# EasyEDA Pro project TDX_Lite_testboard_1.0.epro

# Board mai_io
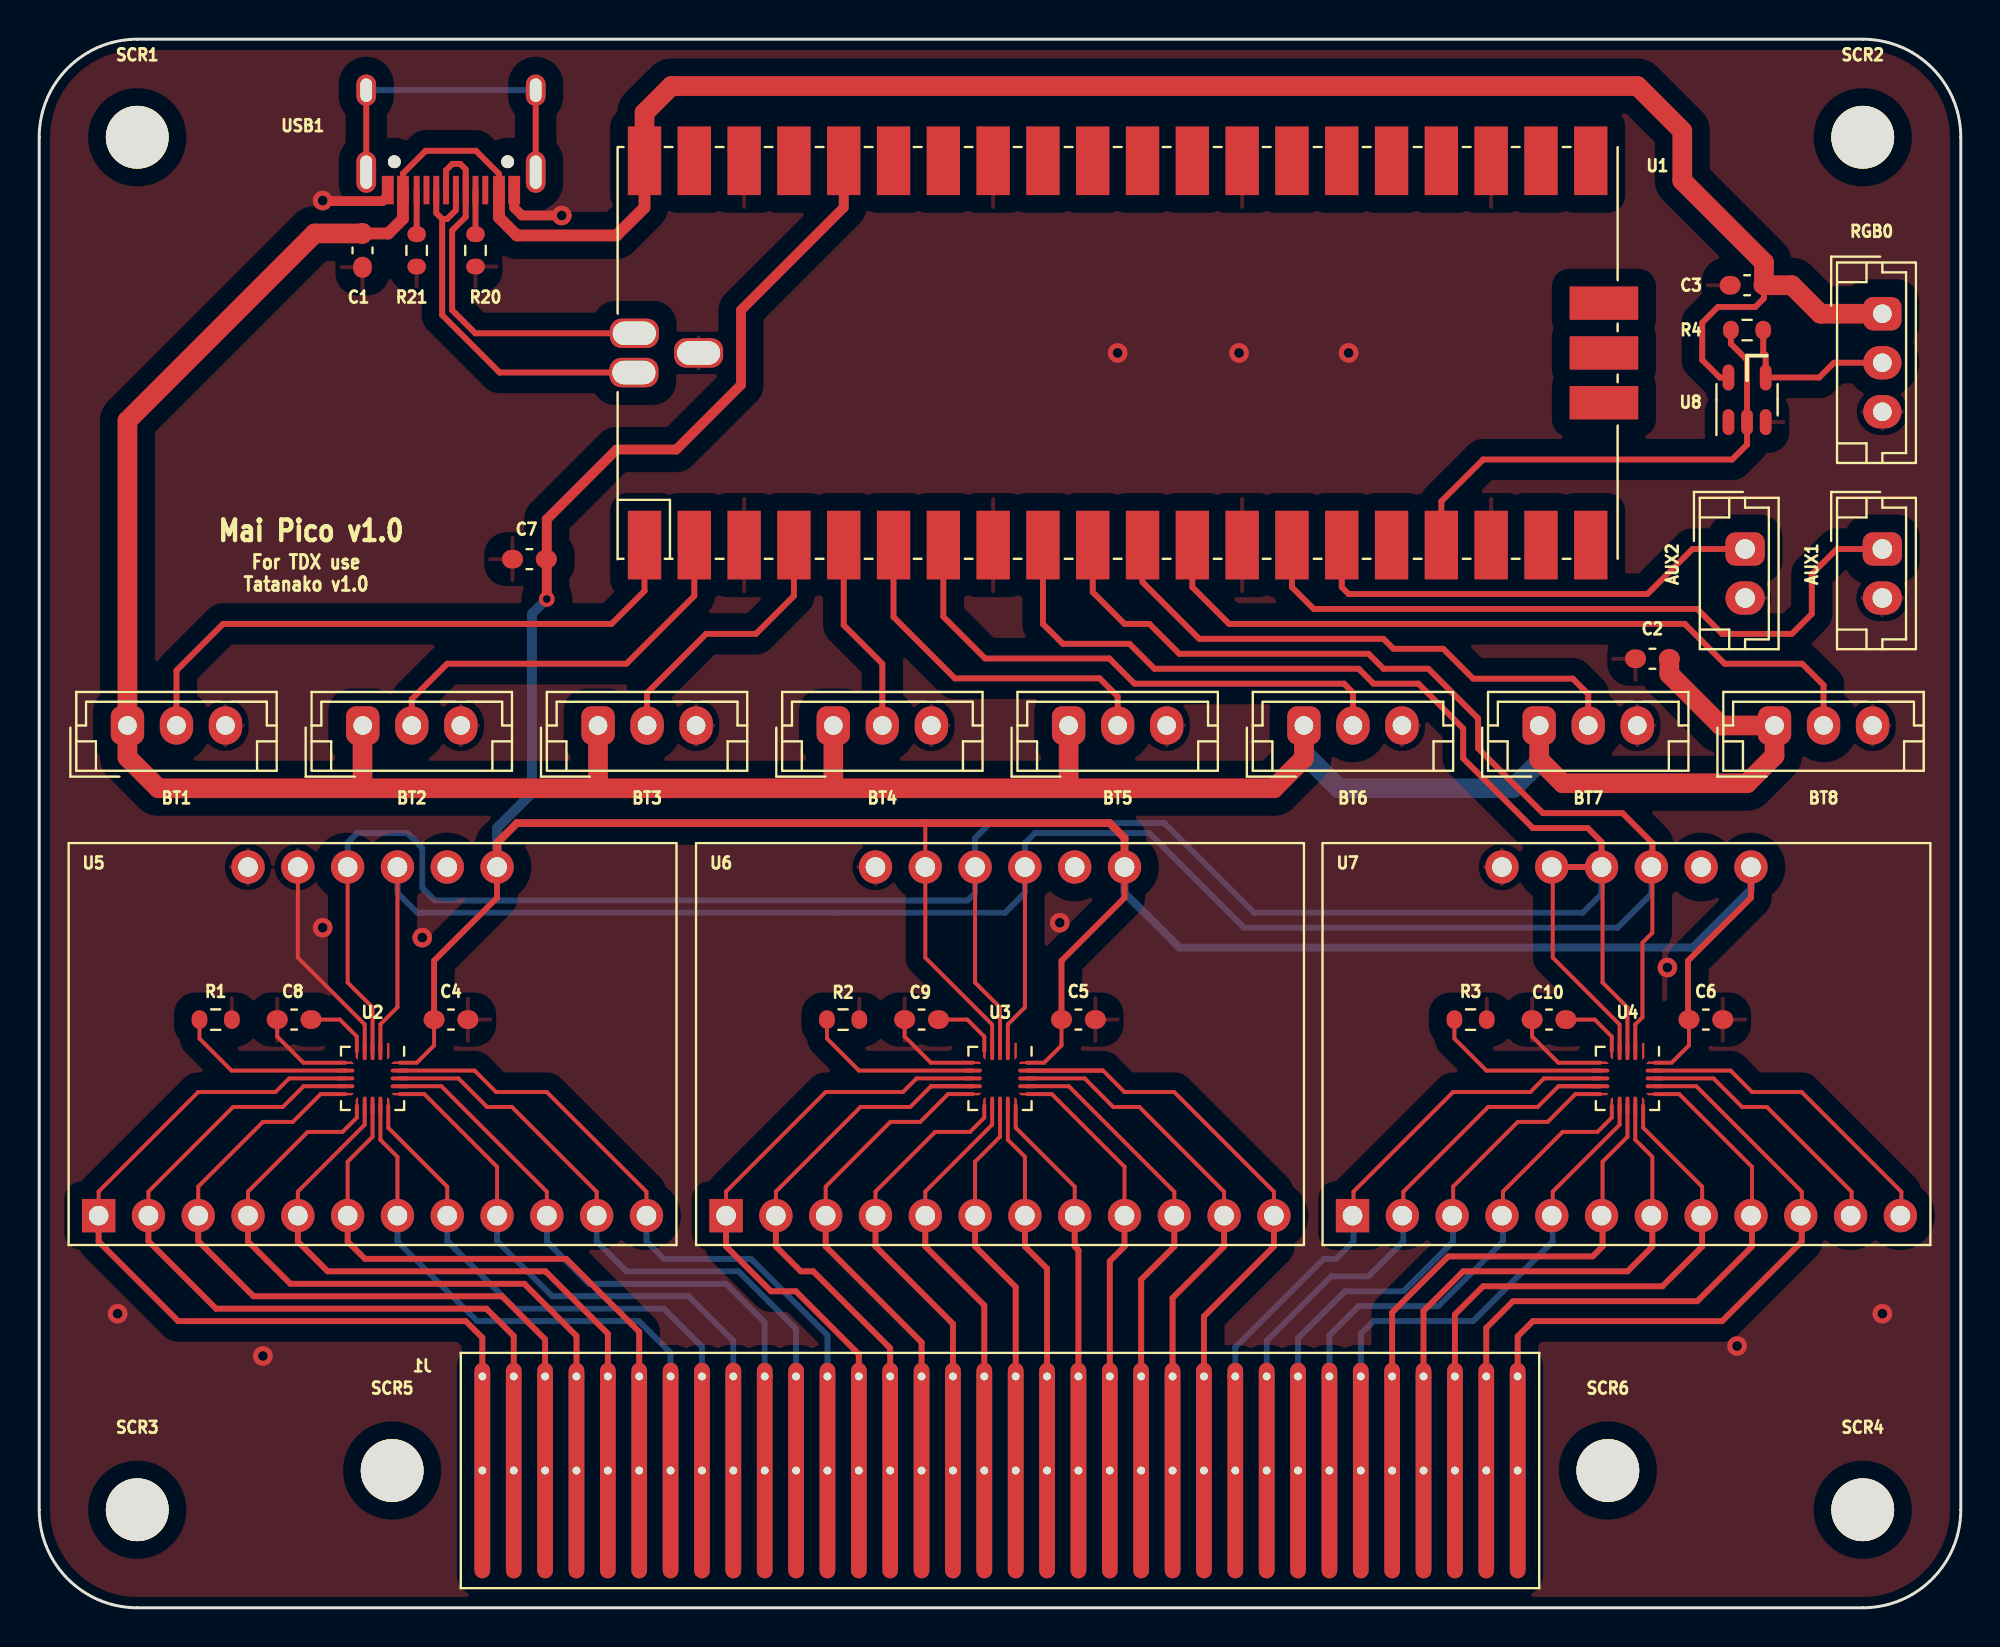
[diagram p0: board, top side]
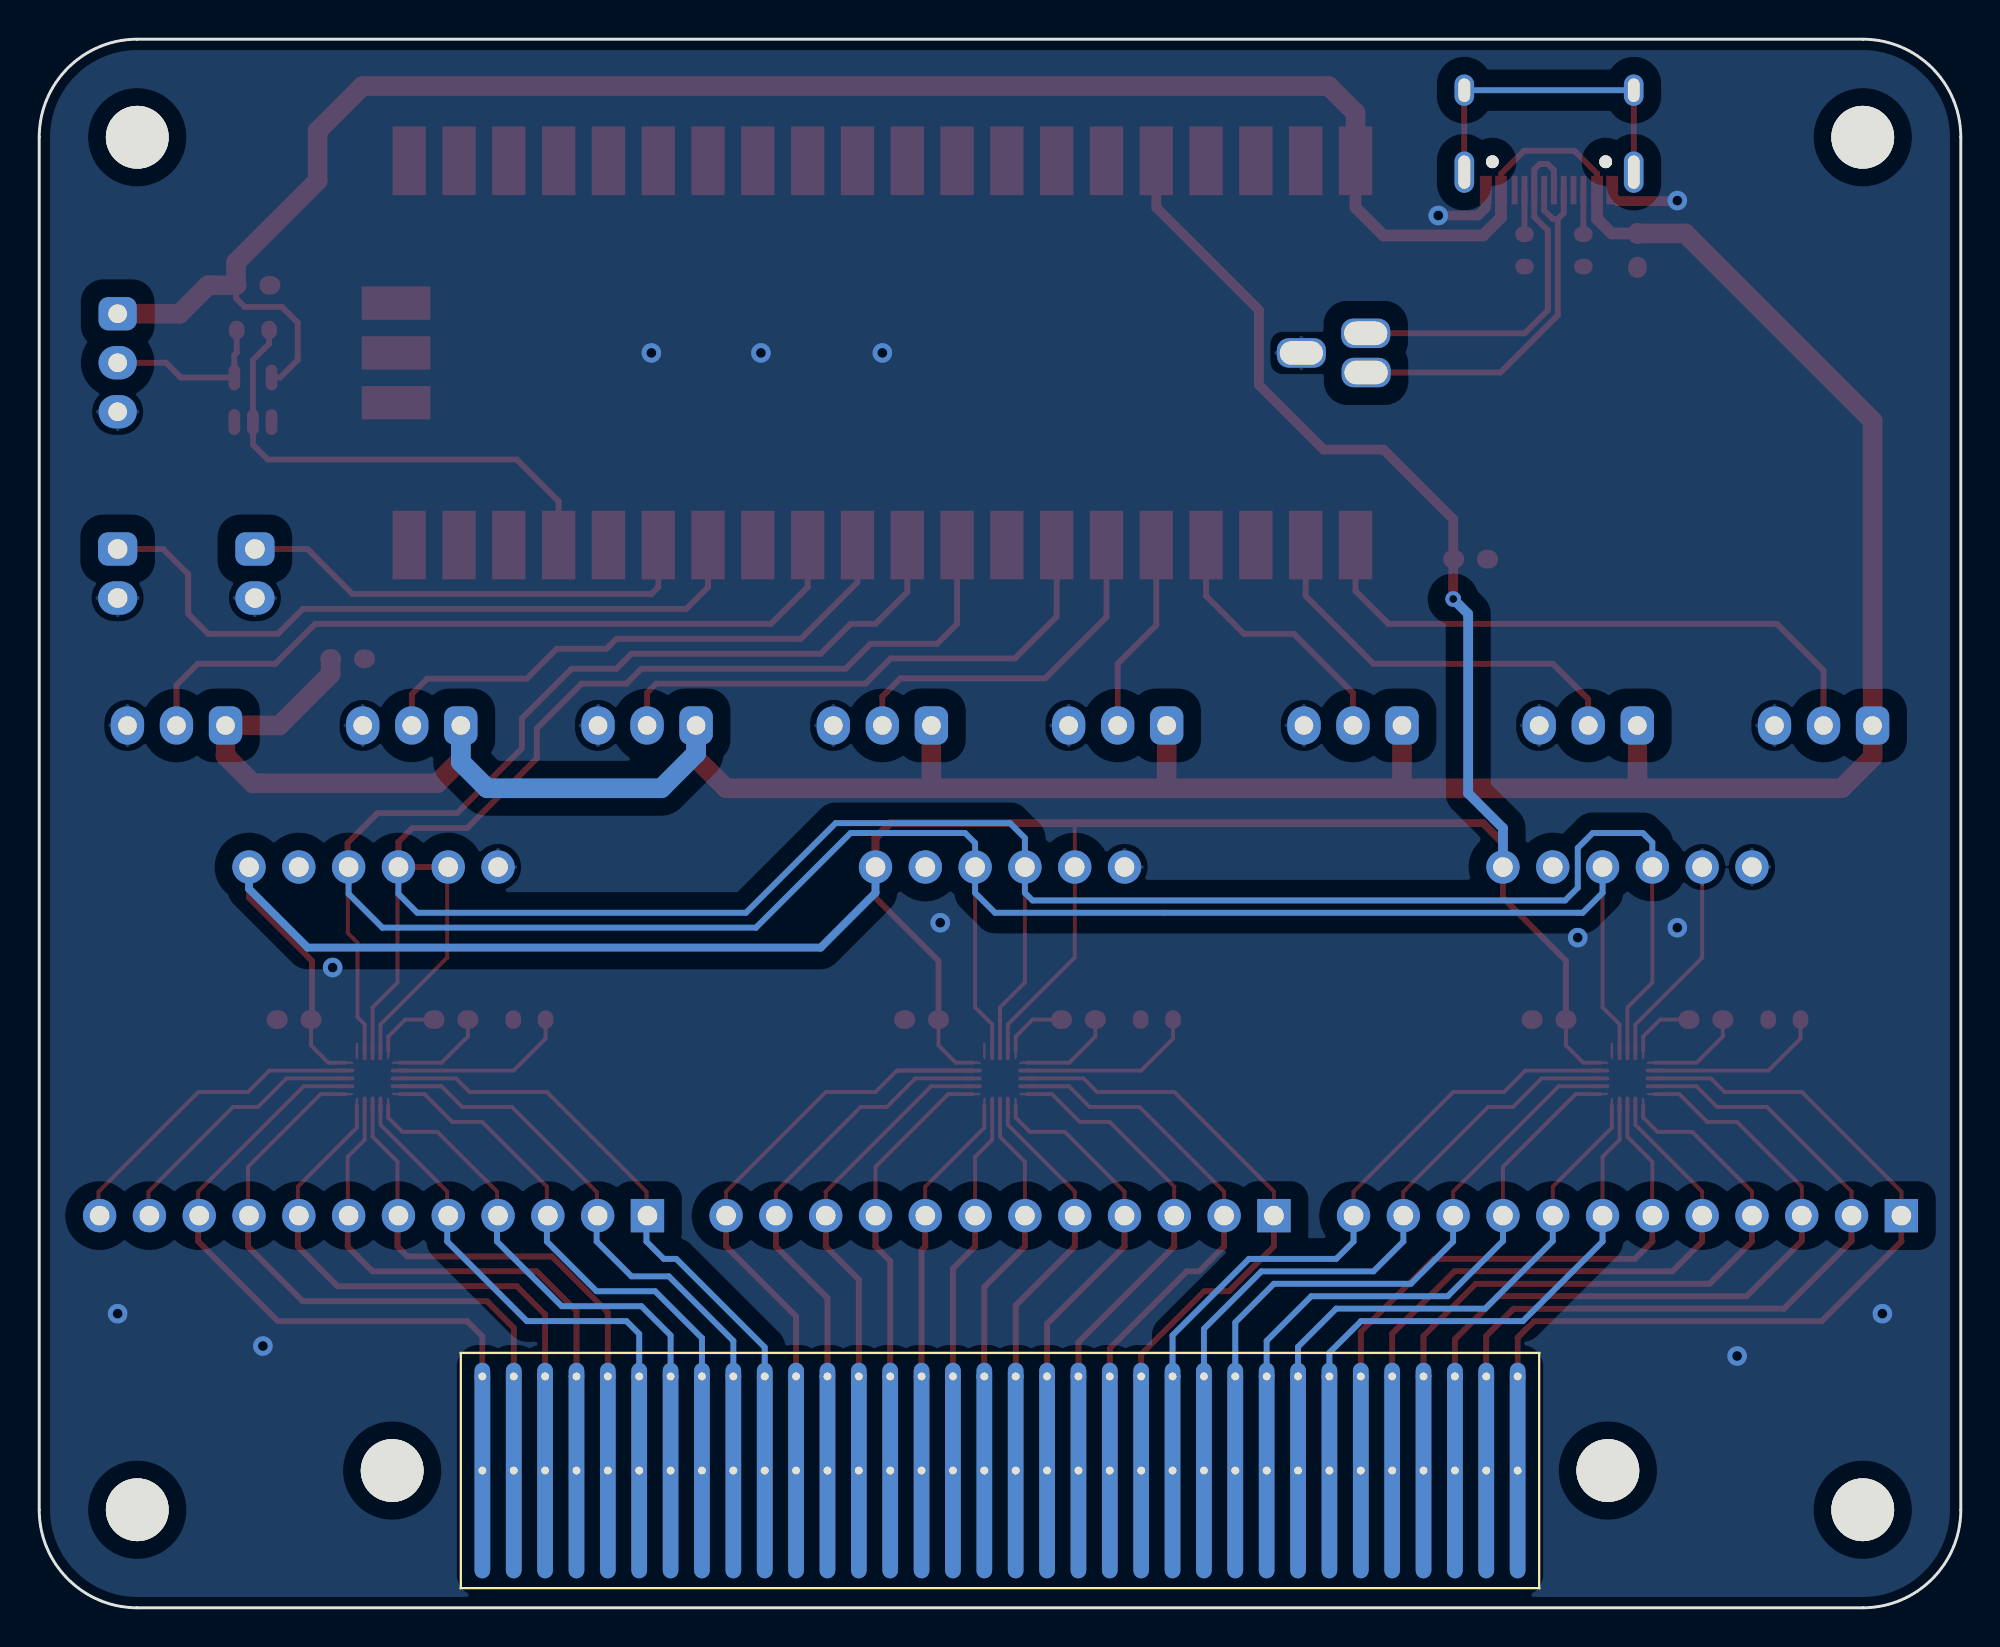
[diagram p1: board, bottom side, seen from below]

Outline 98 x 80 mm; copper layers: Top Layer, Bottom Layer. Coordinates in mm from the lower left corner of the outline.
Outline path: 0,75 arc(1.46,78.54) 5,80 93,80 arc(96.54,78.54) 98,75 98,5 arc(96.54,1.46) 93,0 5,0 arc(1.46,1.46) 0,5 0,75
Stack: Top Layer 0.0009mm / dielectric 1 0.0282mm FR4 er 4.5 / Bottom Layer 0.0009mm

## Design rules (mm)
spacing safeClearance (default): track to track 0.152, other pairs 0.152 to 0.3
track width trackWidth (default): min 0.127, default 0.254, max 2.54
differential pair differentialPair (default): width min 0.127, default 0.254, max 2.54; gap min 0.152, default 0.152
via viaSize (default): diameter min 0.5, default 0.61, max 10; hole min 0.3, default 0.305, max 6
net GND uses CopperRegion1
pour ie1121 uses CopperRegion
pour ie1122 uses CopperRegion1

## Placement (name value [footprint] x y rotation side)
AUX1  Conn_01x02  [Connector_JST:JST_EH_B2B-EH-A_1x02_P2.50mm_Vertical]  94 54 270 top
AUX2  Conn_01x02  [Connector_JST:JST_EH_B2B-EH-A_1x02_P2.50mm_Vertical]  87 54 270 top
BT1  Conn_01x03  [Connector_JST:JST_EH_B3B-EH-A_1x03_P2.50mm_Vertical]  4.5 45 0 top
BT2  Conn_01x03  [Connector_JST:JST_EH_B3B-EH-A_1x03_P2.50mm_Vertical]  16.5 45 0 top
BT3  Conn_01x03  [Connector_JST:JST_EH_B3B-EH-A_1x03_P2.50mm_Vertical]  28.5 45 0 top
BT4  Conn_01x03  [Connector_JST:JST_EH_B3B-EH-A_1x03_P2.50mm_Vertical]  40.5 45 0 top
BT5  Conn_01x03  [Connector_JST:JST_EH_B3B-EH-A_1x03_P2.50mm_Vertical]  52.5 45 0 top
BT6  Conn_01x03  [Connector_JST:JST_EH_B3B-EH-A_1x03_P2.50mm_Vertical]  64.5 45 0 top
BT7  Conn_01x03  [Connector_JST:JST_EH_B3B-EH-A_1x03_P2.50mm_Vertical]  76.5 45 0 top
BT8  Conn_01x03  [Connector_JST:JST_EH_B3B-EH-A_1x03_P2.50mm_Vertical]  88.5 45 0 top
C1  0.1uF  [Capacitor_SMD:C_0603_1608Metric_Pad1.08x0.95mm_HandSolder]  16.49 69.23 270 top
C2  0.1uF  [Capacitor_SMD:C_0603_1608Metric_Pad1.08x0.95mm_HandSolder]  82.27 48.4 180 top
C3  0.1uF  [Capacitor_SMD:C_0603_1608Metric_Pad1.08x0.95mm_HandSolder]  87.1 67.45 180 top
C4  0.1uF  [Capacitor_SMD:C_0603_1608Metric_Pad1.08x0.95mm_HandSolder]  21 30 0 top
C5  0.1uF  [Capacitor_SMD:C_0603_1608Metric_Pad1.08x0.95mm_HandSolder]  53 30 0 top
C6  0.1uF  [Capacitor_SMD:C_0603_1608Metric_Pad1.08x0.95mm_HandSolder]  85 30 0 top
C7  0.1uF  [Capacitor_SMD:C_0603_1608Metric_Pad1.08x0.95mm_HandSolder]  25 53.48 180 top
C8  0.1uF  [Capacitor_SMD:C_0603_1608Metric_Pad1.08x0.95mm_HandSolder]  13 30 180 top
C9  0.1uF  [Capacitor_SMD:C_0603_1608Metric_Pad1.08x0.95mm_HandSolder]  45 30 180 top
C10  0.1uF  [Capacitor_SMD:C_0603_1608Metric_Pad1.08x0.95mm_HandSolder]  77 30 180 top
J1  Conn_01x34_Female  [mai_io:MaiTouch_Conn34]  49 7 0 bottom
R1  75K  [Resistor_SMD:R_0603_1608Metric]  9 30 0 top
R2  75K  [Resistor_SMD:R_0603_1608Metric]  41 30 0 top
R3  75K  [Resistor_SMD:R_0603_1608Metric]  73 30 0 top
R4  10  [Resistor_SMD:R_0603_1608Metric]  87.1 65.17 180 top
R20  5K1  [Resistor_SMD:R_0603_1608Metric]  22.25 69.23 270 top
R21  5K1  [Resistor_SMD:R_0603_1608Metric]  19.25 69.23 270 top
RGB0  Conn_01x03  [Connector_JST:JST_EH_B3B-EH-A_1x03_P2.50mm_Vertical]  94 66 270 top
SCR1  ScrewHole  [mai_io:MountingHole_3.2mm_M3]  5 75 0 top
SCR2  ScrewHole  [mai_io:MountingHole_3.2mm_M3]  93 75 0 top
SCR3  ScrewHole  [mai_io:MountingHole_3.2mm_M3]  5 5 0 top
SCR4  ScrewHole  [mai_io:MountingHole_3.2mm_M3]  93 5 0 top
SCR5  ScrewHole  [mai_io:MountingHole_3.2mm_M3]  18 7 0 top
SCR6  ScrewHole  [mai_io:MountingHole_3.2mm_M3]  80 7 0 top
U1  Pico  [mai_io:RPi_Pico_SMD_Pins]  55 64 90 top
U2  MPR121QR2  [Package_DFN_QFN:UQFN-20_3x3mm_P0.4mm]  17 27 270 top
U3  MPR121QR2  [Package_DFN_QFN:UQFN-20_3x3mm_P0.4mm]  49 27 270 top
U4  MPR121QR2  [Package_DFN_QFN:UQFN-20_3x3mm_P0.4mm]  81 27 270 top
U5  MPR121QR2_BOARD  [mai_io:MPR121_BOARD]  17 20 0 top
U6  MPR121QR2_BOARD  [mai_io:MPR121_BOARD]  49 20 0 top
U7  MPR121QR2_BOARD  [mai_io:MPR121_BOARD]  80.95 20 0 top
U8  SN74LV1T34DBV  [mai_io:SOT-23-5_Jumper]  87.1 61.61 90 top
USB1  U262-161N-4BVC11  [Type-C:HRO-TYPE-C-31-M-12-Assembly]  21 80 180 top

## Footprints (pads in the part's own frame, mm; a bottom-side part is the same pattern mirrored in y, then rotated)
Capacitor_SMD:C_0603_1608Metric_Pad1.08x0.95mm_HandSolder
  rrect 1.075x0.95 smd: 1(-0.863,0) 2(0.863,0)
Connector_JST:JST_EH_B2B-EH-A_1x02_P2.50mm_Vertical
  rrect 1.7x2 hole 1: 1(0,0)
  oval 1.7x2 hole 1: 2(2.5,0)
Connector_JST:JST_EH_B3B-EH-A_1x03_P2.50mm_Vertical
  rrect 1.7x1.95 hole 0.95: 1(0,0)
  oval 1.7x1.95 hole 0.95: 2(2.5,0) 3(5,0)
mai_io:MaiTouch_Conn34
  round 0.8 hole 0.4: 1(-26.4,-4.8) 2(-24.8,-4.8) 3(-23.2,-4.8) 4(-21.6,-4.8) 5(-20,-4.8) 6(-18.4,-4.8) 7(-16.8,-4.8) 8(-15.2,-4.8) 9(-13.6,-4.8) 10(-12,-4.8) 11(-10.4,-4.8) 12(-8.8,-4.8) 13(-7.2,-4.8) 14(-5.6,-4.8) 15(-4,-4.8) 16(-2.4,-4.8) 17(-0.8,-4.8) 18(0.8,-4.8) 19(2.4,-4.8) 20(4,-4.8) 21(5.6,-4.8) 22(7.2,-4.8) 23(8.8,-4.8) 24(10.4,-4.8) 25(12,-4.8) 26(13.6,-4.8) 27(15.2,-4.8) 28(16.8,-4.8) 29(18.4,-4.8) 30(20,-4.8) 31(21.6,-4.8) 32(23.2,-4.8) 33(24.8,-4.8) 34(26.4,-4.8)
  rrect 0.8x11 hole 0.4: 1(-26.4,0) 2(-24.8,0) 3(-23.2,0) 4(-21.6,0) 5(-20,0) 6(-18.4,0) 7(-16.8,0) 8(-15.2,0) 9(-13.6,0) 10(-12,0) 11(-10.4,0) 12(-8.8,0) 13(-7.2,0) 14(-5.6,0) 15(-4,0) 16(-2.4,0) 17(-0.8,0) 18(0.8,0) 19(2.4,0) 20(4,0) 21(5.6,0) 22(7.2,0) 23(8.8,0) 24(10.4,0) 25(12,0) 26(13.6,0) 27(15.2,0) 28(16.8,0) 29(18.4,0) 30(20,0) 31(21.6,0) 32(23.2,0) 33(24.8,0) 34(26.4,0)
mai_io:MountingHole_3.2mm_M3
  round 3.2 hole 3.2: (0,0)
mai_io:MPR121_BOARD
  round 1.7 hole 1: 1(3.81,17.78) 2(1.27,17.78) 3(-1.27,17.78) 4(-3.81,17.78) 6(-6.35,17.78) 9(-11.43,0) 10(-8.89,0) 11(-6.35,0) 12(-3.81,0) 13(-1.27,0) 14(1.27,0) 15(3.81,0) 16(6.35,0) 17(8.89,0) 18(11.43,0) 19(13.97,0) 20(6.35,17.78)
  rect 1.7x1.7 hole 1: 8(-13.97,0)
mai_io:RPi_Pico_SMD_Pins
  rect 3.5x1.7 smd: 1(-9.8,24.13) 2(-9.8,21.59) 3(-9.8,19.05) 4(-9.8,16.51) 5(-9.8,13.97) 6(-9.8,11.43) 7(-9.8,8.89) 8(-9.8,6.35) 9(-9.8,3.81) 10(-9.8,1.27) 11(-9.8,-1.27) 12(-9.8,-3.81) 13(-9.8,-6.35) 14(-9.8,-8.89) 15(-9.8,-11.43) 16(-9.8,-13.97) 17(-9.8,-16.51) 18(-9.8,-19.05) 19(-9.8,-21.59) 20(-9.8,-24.13) 21(9.8,-24.13) 22(9.8,-21.59) 23(9.8,-19.05) 24(9.8,-16.51) 25(9.8,-13.97) 26(9.8,-11.43) 27(9.8,-8.89) 28(9.8,-6.35) 29(9.8,-3.81) 30(9.8,-1.27) 31(9.8,1.27) 32(9.8,3.81) 33(9.8,6.35) 34(9.8,8.89) 35(9.8,11.43) 36(9.8,13.97) 37(9.8,16.51) 38(9.8,19.05) 39(9.8,21.59) 40(9.8,24.13)
  rect 1.7x3.5 smd: 41(-2.54,-24.8) 42(0,-24.8) 43(2.54,-24.8)
  rrect 1.5x2.5 hole 1.2x2.2: TP1(0,21.37) TP2(1,24.65) TP3(-1,24.67)
mai_io:SOT-23-5_Jumper
  rrect 1.325x0.6 smd: 1(-1.137,0.95) 2(-1.137,0) 3(-1.137,-0.95) 4(1.137,-0.95) 5(1.137,0.95)
Package_DFN_QFN:UQFN-20_3x3mm_P0.4mm
  custom 0.845x0.12 smd: 1(-1.387,0.8) 5(-1.387,-0.8) 11(1.387,-0.8) 15(1.387,0.8)
  rrect 0.925x0.2 smd: 2(-1.387,0.4) 3(-1.387,0) 4(-1.387,-0.4) 12(1.387,-0.4) 13(1.387,0) 14(1.387,0.4)
  custom 0.12x0.845 smd: 6(-0.8,-1.387) 10(0.8,-1.387) 16(0.8,1.387) 20(-0.8,1.387)
  rrect 0.2x0.925 smd: 7(-0.4,-1.387) 8(0,-1.387) 9(0.4,-1.387) 17(0.4,1.387) 18(0,1.387) 19(-0.4,1.387)
Resistor_SMD:R_0603_1608Metric
  rrect 0.8x0.95 smd: 1(-0.825,0) 2(0.825,0)
Type-C:HRO-TYPE-C-31-M-12-Assembly
  round 0.65 hole 0.65: (-2.89,6.25) (2.89,6.25)
  rect 0.6x1.45 smd: 1(-3.225,7.695) 2(-2.45,7.695) 11(2.45,7.695) 12(3.225,7.695)
  rect 0.3x1.45 smd: 3(-1.75,7.695) 4(-1.25,7.695) 5(-0.75,7.695) 6(-0.25,7.695) 7(0.25,7.695) 8(0.75,7.695) 9(1.25,7.695) 10(1.75,7.695)
  oval 1x2.1 hole 0.6x1.7: 13(-4.32,6.78) 13(4.32,6.78)
  oval 1x1.6 hole 0.6x1.2: 13(-4.32,2.6) 13(4.32,2.6)

## Nets
+3V3: C4.1 C5.1 C6.1 C7.1 U1.36 U2.20 U3.4 U3.20 U4.20 U5.20 U6.4 U6.20 U7.20
+5V: BT1.1 BT2.1 BT3.1 BT4.1 BT5.1 BT6.1 BT7.1 BT8.1 C1.1 C2.1 C3.1 RGB0.1 U1.40 U8.5 USB1.2 USB1.11
GND: AUX1.2 AUX2.2 BT1.3 BT2.3 BT3.3 BT4.3 BT5.3 BT6.3 BT7.3 BT8.3 C1.2 C2.2 C3.2 C4.2 C5.2 C6.2 C7.2 C8.2 C9.2 C10.2 R1.2 R2.2 R3.2 R20.2 R21.2 RGB0.3 U1.3 U1.8 U1.13 U1.18 U1.23 U1.28 U1.33 U1.38 U1.TP1 U2.4 U2.6 U3.6 U4.6 U5.4 U5.6 U6.6 U7.6 U8.3 USB1.1 USB1.12
/A1: J1.1 U2.8 U5.8
/A2: J1.2 U2.9 U5.9
/A3: J1.3 U2.10 U5.10
/A4: J1.4 U2.11 U5.11
/A5: J1.5 U2.12 U5.12
/A6: J1.6 U2.13 U5.13
/A7: J1.7 U2.14 U5.14
/A8: J1.8 U2.15 U5.15
/A9: J1.9 U2.16 U5.16
/A10: J1.10 U2.17 U5.17
/A11: J1.11 U2.18 U5.18
/A12: J1.12 U2.19 U5.19
/B1: J1.13 U3.8 U6.8
/B2: J1.14 U3.9 U6.9
/B3: J1.15 U3.10 U6.10
/B4: J1.16 U3.11 U6.11
/B5: J1.17 U3.12 U6.12
/B6: J1.18 U3.13 U6.13
/B7: J1.19 U3.14 U6.14
/B8: J1.20 U3.15 U6.15
/B9: J1.21 U3.16 U6.16
/B10: J1.22 U3.17 U6.17
/B11: J1.23 U3.18 U6.18
/B12: J1.24 U3.19 U6.19
/C1: J1.25 U4.8 U7.8
/C2: J1.26 U4.9 U7.9
/C3: J1.27 U4.10 U7.10
/C4: J1.28 U4.11 U7.11
/C5: J1.29 U4.12 U7.12
/C6: J1.30 U4.13 U7.13
/C7: J1.31 U4.14 U7.14
/C8: J1.32 U4.15 U7.15
/C9: J1.33 U4.16 U7.16
/C10: J1.34 U4.17 U7.17
/C11: U4.18 U7.18
/C12: U4.19 U7.19
/SCL: U1.10 U2.2 U3.2 U4.2 U5.2 U6.2 U7.2
/SDA: U1.9 U2.3 U3.3 U4.3 U4.4 U5.3 U6.3 U7.3 U7.4
NET-(AUX1-PAD1): AUX1.1 U1.14
NET-(AUX2-PAD1): AUX2.1 U1.15
NET-(BT1-PAD2): BT1.2 U1.1
NET-(BT2-PAD2): BT2.2 U1.2
NET-(BT3-PAD2): BT3.2 U1.4
NET-(BT4-PAD2): BT4.2 U1.5
NET-(BT5-PAD2): BT5.2 U1.6
NET-(BT6-PAD2): BT6.2 U1.7
NET-(BT7-PAD2): BT7.2 U1.11
NET-(BT8-PAD2): BT8.2 U1.12
NET-(C8-PAD1): C8.1 U2.5
NET-(C9-PAD1): C9.1 U3.5
NET-(C10-PAD1): C10.1 U4.5
NET-(R1-PAD1): R1.1 U2.7
NET-(R2-PAD1): R2.1 U3.7
NET-(R3-PAD1): R3.1 U4.7
NET-(R4-PAD1): R4.1 RGB0.2 U8.4
NET-(R4-PAD2): R4.2 U1.17 U8.2
NET-(R20-PAD1): R20.1 USB1.4
NET-(R21-PAD1): R21.1 USB1.10
NET-(U1-PADTP2): U1.TP2 USB1.5 USB1.7
NET-(U1-PADTP3): U1.TP3 USB1.6 USB1.8
UNCONNECTED-(U1-PAD16): U1.16
UNCONNECTED-(U1-PAD19): U1.19
UNCONNECTED-(U1-PAD20): U1.20
UNCONNECTED-(U1-PAD21): U1.21
UNCONNECTED-(U1-PAD22): U1.22
UNCONNECTED-(U1-PAD24): U1.24
UNCONNECTED-(U1-PAD25): U1.25
UNCONNECTED-(U1-PAD26): U1.26
UNCONNECTED-(U1-PAD27): U1.27
UNCONNECTED-(U1-PAD29): U1.29
UNCONNECTED-(U1-PAD30): U1.30
UNCONNECTED-(U1-PAD31): U1.31
UNCONNECTED-(U1-PAD32): U1.32
UNCONNECTED-(U1-PAD34): U1.34
UNCONNECTED-(U1-PAD35): U1.35
UNCONNECTED-(U1-PAD37): U1.37
UNCONNECTED-(U1-PAD39): U1.39
UNCONNECTED-(U1-PAD41): U1.41
UNCONNECTED-(U1-PAD42): U1.42
UNCONNECTED-(U1-PAD43): U1.43
UNCONNECTED-(U2-PAD1): U2.1
UNCONNECTED-(U3-PAD1): U3.1
UNCONNECTED-(U4-PAD1): U4.1
UNCONNECTED-(U5-PAD1): U5.1
UNCONNECTED-(U6-PAD1): U6.1
UNCONNECTED-(U7-PAD1): U7.1
UNCONNECTED-(U8-PAD1): U8.1
UNCONNECTED-(USB1-PAD3): USB1.3
UNCONNECTED-(USB1-PAD9): USB1.9
UNCONNECTED-(USB1-PAD13): USB1.13

## Via types
v1: diameter 1, hole 0.5, Top Layer to Bottom Layer, 13 vias
v2: diameter 0.8, hole 0.4, Top Layer to Bottom Layer, 1 via

## Routing (per net, layer and track width the routed paths; a pad name or vN(x,y) marks a point on that pad's centre or on a via; arc(x,y) is an arc through that point)
+3V3: length 168
  Top Layer w0.2: U3.20 51.25,27.8 52.14,28.68 C5.1 ; U2.20 19.25,27.8 20.14,28.68 C4.1 ; C6.1 84.14,28.68 83.25,27.8 U4.20 ; U3.4 48.6,29.75 45.19,33.16 U6.4 45.19,40.02
  Top Layer w0.3: U7.20 87.3,36.21 84.09,33 84.09,30 ; C5.1 52.14,33 55.35,36.21 U6.20 ; U5.20 23.35,36.21 20.14,33 C4.1
  Top Layer w0.4: U6.20 55.35,39.26 54.59,40.02 24.36,40.02 23.35,39.01 U5.20
  Top Layer w0.5: U1.36 41.03,71.42 35.79,66.18 35.79,62.37 32.49,59.07 29.44,59.07 25.89,55.51 v2(25.89,51.45)
  Bottom Layer w0.4: U6.20 55.35,36.46 58.14,33.67 84.31,33.67 87.3,36.66 U7.20
  Bottom Layer w0.5: v2(25.89,51.45) 25.12,50.69 25.12,41.54 23.35,39.77 U5.20
+5V: length 253.4
  Top Layer w0.3: C3.1 87.96,66.79 87.52,66.35 85.62,66.35 84.81,65.54 84.81,63.64 85.71,62.75 U8.5 ; USB1.2 23.45,73.13 22.27,74.31 19.71,74.31 18.55,73.15 USB1.11
  Top Layer w0.6: USB1.2 23.45,70.9 24.36,69.99 29.44,69.99 30.87,71.42 U1.40 ; USB1.11 18.55,70.84 17.8,70.09 C1.1
  Top Layer w1: BT2.1 16.49,44.99 16.49,41.8 ; C2.1 83.14,47.62 85.76,45 BT8.1 88.5,43.45 87.1,42.05 77.7,42.05 76.5,43.25 BT7.1 ; 16.49,41.8 6.07,41.8 4.5,43.37 BT1.1 4.5,60.54 14.05,70.09 C1.1 ; 16.49,41.8 62.97,41.8 64.5,43.33 BT6.1 ; BT3.1 28.5,41.87 ; BT5.1 52.5,41.85 ; RGB0.1 90.84,66 89.39,67.45 C3.1 87.96,68.62 83.8,72.79 83.8,75.33 81.51,77.61 32.24,77.61 30.87,76.25 U1.40 ; BT4.1 40.5,41.92
  Bottom Layer w1: BT6.1 64.5,43.57 66.27,41.8 75.16,41.8 76.5,43.14 BT7.1
GND: length 33
  Top Layer w0.2: U2.6 13.47,27.8 12.14,29.13 C8.2 ; U4.6 77.47,27.8 76.14,29.13 C10.2 ; U2.4 16.6,29.75 13.19,33.16 U5.4 ; C9.2 44.14,29.13 45.47,27.8 U3.6
  Top Layer w0.5: v1(14.46,71.77) 14.48,71.75 17.5,71.75 17.78,72.02 USB1.12 ; 26.91,71.01 24.62,71.01 24.23,71.4 USB1.1
  vias: v1(4,15) v1(11.41,12.84) v1(14.46,34.69) v1(19.54,34.18) v1(26.65,71.01) v1(52.05,34.94) v1(55,64) v1(61.19,64) v1(66.78,64) v1(83.04,32.65) v1(86.59,13.35) v1(94,15)
/A1: length 45.9
  Top Layer w0.2: U5.8 3.03,21.23 8.11,26.3 12.05,26.3 12.74,27 U2.8
  Top Layer w0.3: J1.1 22.6,13.77 21.75,14.62 7.09,14.62 3.03,18.68 U5.8
/A2: length 42.3
  Top Layer w0.2: U2.9 13.48,26.6 12.42,25.54 9.88,25.54 5.57,21.23 U5.9
  Top Layer w0.3: J1.2 24.2,13.86 22.81,15.26 9.02,15.26 5.57,18.71 U5.9
/A3: length 38.7
  Top Layer w0.2: U5.10 8.11,21.48 11.41,24.78 12.93,24.78 14.35,26.2 U2.10
  Top Layer w0.3: J1.3 25.8,13.69 23.6,15.89 10.93,15.89 8.11,18.71 U5.10
/A4: length 35.9
  Top Layer w0.2: U5.11 10.65,21.23 13.69,24.27 15.47,24.27 16.2,25 U2.11
  Top Layer w0.3: J1.4 27.4,13.87 24.74,16.53 12.81,16.53 10.65,18.68 U5.11
/A5: length 33.1
  Top Layer w0.2: U2.12 16.6,24.64 13.19,21.23 U5.12
  Top Layer w0.3: U5.12 13.19,18.68 14.71,17.16 25.82,17.16 29,13.98 J1.5
/A6: length 31.3
  Top Layer w0.2: U5.13 15.73,22.75 17,24.02 U2.13
  Top Layer w0.3: J1.6 30.6,14.07 26.88,17.8 16.62,17.8 15.73,18.68 U5.13
/A7: length 29.6
  Top Layer w0.2: U2.14 17.4,23.87 18.27,23 U5.14
  Bottom Layer w0.3: J1.7 32.2,13.01 30.59,14.62 22.33,14.62 18.27,18.68 U5.14
/A8: length 29.7
  Top Layer w0.2: U5.15 20.81,21.47 17.8,24.48 U2.15
  Bottom Layer w0.3: U5.15 20.81,18.71 24.26,15.26 31.86,15.26 33.8,13.31 J1.8
/A9: length 31.1
  Top Layer w0.2: U2.16 19.64,26.2 23.35,22.49 U5.16
  Bottom Layer w0.3: U5.16 23.35,18.71 26.17,15.89 33.12,15.89 35.4,13.62 J1.9
/A10: length 32.6
  Top Layer w0.2: U2.17 20.51,26.6 25.89,21.22 U5.17
  Bottom Layer w0.3: U5.17 25.89,18.68 28.05,16.53 35.03,16.53 37,14.56 J1.10
/A11: length 34.2
  Top Layer w0.2: U2.18 21.38,27 22.84,25.54 24.11,25.54 28.43,21.22 U5.18
  Bottom Layer w0.3: J1.11 38.6,14.23 35.67,17.16 29.95,17.16 28.43,18.68 U5.18
/A12: length 35.8
  Top Layer w0.2: U5.19 30.97,21.22 25.89,26.3 23.3,26.3 22.2,27.4 U2.19
  Bottom Layer w0.3: U5.19 30.97,18.68 31.86,17.8 36.3,17.8 40.2,13.9 J1.12
/B1: length 32.7
  Top Layer w0.2: U6.8 35.03,21.23 40.11,26.3 44.05,26.3 44.74,27 U3.8
  Top Layer w0.3: U6.8 35.03,18.43 37.32,16.14 38.59,16.14 41.8,12.93 J1.13
/B2: length 31.4
  Top Layer w0.2: 45.48,26.6 U3.9 45.48,26.6 ; 45.48,26.6 44.42,25.54 41.88,25.54 37.57,21.23 U6.9
  Top Layer w0.3: J1.14 43.4,13.23 39.47,17.16 38.84,17.16 37.57,18.43 U6.9
/B3: length 26
  Top Layer w0.2: U3.10 46.35,26.2 44.93,24.78 43.41,24.78 40.11,21.48 U6.10
  Top Layer w0.3: J1.15 45,13.54 40.11,18.43 U6.10
/B4: length 23.6
  Top Layer w0.2: U6.11 42.65,21.23 45.69,24.27 47.47,24.27 48.2,25 U3.11
  Top Layer w0.3: J1.16 46.6,14.48 42.65,18.43 U6.11
/B5: length 21.3
  Top Layer w0.2: U6.12 45.19,21.23 48.6,24.64 U3.12
  Top Layer w0.3: J1.17 48.2,15.42 45.19,18.43 U6.12
/B6: length 20
  Top Layer w0.2: U3.13 49,24.02 47.73,22.75 U6.13
  Top Layer w0.3: J1.18 49.8,16.36 47.73,18.43 U6.13
/B7: length 19.4
  Top Layer w0.2: U3.14 49.4,23.87 50.27,23 U6.14
  Top Layer w0.3: U6.14 50.27,18.43 51.4,17.3 J1.19
/B8: length 19.9
  Top Layer w0.2: U3.15 49.8,24.48 52.81,21.47 U6.15
  Top Layer w0.3: U6.15 52.81,18.43 53,18.24 J1.20
/B9: length 22.3
  Top Layer w0.2: U6.16 55.35,22.49 51.64,26.2 U3.16
  Top Layer w0.3: J1.21 54.6,17.68 55.35,18.43 U6.16
/B10: length 24.7
  Top Layer w0.2: U3.17 52.51,26.6 57.89,21.22 U6.17
  Top Layer w0.3: J1.22 56.2,16.74 57.89,18.43 U6.17
/B11: length 27.7
  Top Layer w0.2: U6.18 60.43,21.22 56.11,25.54 54.78,25.54 53.32,27 U3.18
  Top Layer w0.3: U6.18 60.43,18.43 57.8,15.8 J1.23
/B12: length 34.7
  Top Layer w0.2: 54.2,27.4 U3.19 54.25,27.4 55.35,26.3 57.89,26.3 62.97,21.22 U6.19
  Top Layer w0.3: U6.19 62.97,18.43 59.4,14.86 J1.24
/C1: length 32.1
  Top Layer w0.2: 67.03,20 67.03,21.23 72.11,26.3 76.05,26.3 76.74,27 U4.8
  Bottom Layer w0.3: J1.25 61,13.29 65.51,17.8 66.15,17.8 67.03,18.68 67.03,20
/C2: length 32.6
  Top Layer w0.2: 77.48,26.6 76.42,25.54 73.89,25.54 69.57,21.22 69.57,20 ; 77.48,26.6 U4.9 77.48,26.6
  Bottom Layer w0.3: J1.26 62.6,13.62 65.89,16.91 67.8,16.91 69.57,18.68 69.57,20
/C3: length 29
  Top Layer w0.2: 72.11,20 72.11,21.48 75.41,24.78 76.93,24.78 78.35,26.2 U4.10
  Bottom Layer w0.3: 72.11,20 72.11,18.68 69.57,16.14 66.59,16.14 64.2,13.75 J1.27
/C4: length 28
  Top Layer w0.2: U4.11 80.2,25 79.47,24.27 77.69,24.27 74.65,21.23 74.65,20
  Bottom Layer w0.3: 74.65,20 74.65,18.68 71.35,15.38 67.29,15.38 65.8,13.89 J1.28
/C5: length 27.1
  Top Layer w0.2: U4.12 80.6,24.64 77.19,21.23 77.19,20
  Bottom Layer w0.3: 77.19,20 77.19,18.68 73.13,14.62 68.05,14.62 67.4,13.97 J1.29
/C6: length 27.9
  Top Layer w0.2: U4.13 81,24.02 79.73,22.75 79.73,20
  Top Layer w0.3: J1.30 69,15.06 71.86,17.92 79.23,17.92 79.73,18.43 79.73,20
/C7: length 28.7
  Top Layer w0.2: 82.27,20 82.27,23 81.4,23.87 U4.14
  Top Layer w0.3: 82.27,20 82.27,18.43 81,17.16 72.62,17.16 70.6,15.14 J1.31
/C8: length 30.4
  Top Layer w0.2: U4.15 81.8,24.48 84.81,21.47 84.81,20
  Top Layer w0.3: 84.81,20 84.81,18.43 82.78,16.4 73.64,16.4 72.2,14.96 J1.32
/C9: length 33.1
  Top Layer w0.2: 87.35,20 87.35,22.49 83.64,26.2 U4.16
  Top Layer w0.3: J1.33 73.8,14.27 75.16,15.64 84.56,15.64 87.35,18.43 87.35,20
/C10: length 35.6
  Top Layer w0.2: U4.17 84.51,26.6 89.89,21.22 89.89,20
  Top Layer w0.3: 89.89,20 89.89,18.68 85.83,14.62 76.18,14.62 75.4,13.84 J1.34
/C11: length 13.7
  Top Layer w0.2: U4.18 85.39,27 86.85,25.54 88.11,25.54 92.43,21.22 92.43,20
/C12: length 16.4
  Top Layer w0.2: U4.19 86.26,27.4 87.35,26.3 89.89,26.3 94.97,21.22 94.97,20
/SCL: length 140.6
  Top Layer w0.2: U6.2 50.27,30.63 49.4,29.76 U3.2 ; U4.2 81.4,29.76 81.77,30.12 81.77,33.92 82.27,34.43 82.27,37.78 ; U2.2 17.4,29.76 18.27,30.63 U5.2
  Top Layer w0.3: U1.10 53.73,51.8 55.35,50.18 56.62,50.18 58.14,48.66 67.8,48.66 68.56,47.89 70.84,47.89 73.38,45.35 73.38,43.83 76.69,40.53 80.75,40.53 82.27,39 82.27,37.83 U7.2
  Bottom Layer w0.3: U7.2 82.22,36.41 80.5,34.69 61.45,34.69 56.62,39.51 50.78,39.51 50.27,39 U6.2 50.27,36.46 49.25,35.45 19.28,35.45 18.27,36.46 U5.2
/SDA: length 157.3
  Top Layer w0.2: U4.4 80.6,29.75 77.19,33.16 77.19,37.78 ; U3.3 49,30.62 47.73,31.89 U6.3 ; U5.3 15.73,31.89 17,30.62 U2.3 ; 79.73,37.78 79.73,31.89 81,30.62 U4.3
  Top Layer w0.3: U1.9 51.19,50.18 52.21,49.16 55.6,49.16 56.87,47.89 67.29,47.89 68.05,47.13 70.34,47.13 72.62,44.85 72.62,43.32 76.18,39.77 78.97,39.77 79.68,39.06 U7.3 U7.4
  Bottom Layer w0.3: U7.3 79.68,36.41 78.72,35.45 61.95,35.45 57.38,40.02 48.49,40.02 47.73,39.26 U6.3 47.73,36.46 47.34,36.08 20.18,36.08 19.54,36.72 19.54,38.75 18.77,39.51 16.21,39.51 15.73,39.03 U5.3
NET-(AUX1-PAD1): length 36.2
  Top Layer w0.3: U1.14 63.89,52.05 65,50.94 84.56,50.94 85.83,49.67 89.39,49.67 90.4,50.69 90.4,52.72 91.68,54 AUX1.1
NET-(AUX2-PAD1): length 23.8
  Top Layer w0.3: U1.15 66.43,52.05 66.78,51.7 82.02,51.7 84.32,54 AUX2.1
NET-(BT1-PAD2): length 30.7
  Top Layer w0.3: U1.1 30.87,51.86 29.19,50.18 9.38,50.18 7,47.8 BT1.2
NET-(BT2-PAD2): length 20.5
  Top Layer w0.3: BT2.2 19,46.34 20.81,48.15 29.95,48.15 33.41,51.61 U1.2
NET-(BT3-PAD2): length 13.8
  Top Layer w0.3: U1.4 38.49,51.61 36.55,49.67 34.01,49.67 31,46.66 BT3.2
NET-(BT4-PAD2): length 10
  Top Layer w0.3: BT4.2 43,48.15 41.03,50.12 U1.5
NET-(BT5-PAD2): length 18.3
  Top Layer w0.3: U1.6 43.57,50.53 46.7,47.4 54.08,47.4 55,46.48 BT5.2
NET-(BT6-PAD2): length 27.8
  Top Layer w0.3: BT6.2 67,46.67 66.54,47.13 55.86,47.13 54.57,48.42 48.24,48.42 46.11,50.55 U1.7
NET-(BT7-PAD2): length 28.6
  Top Layer w0.3: BT7.2 79,46.6 78.21,47.39 73.13,47.39 71.61,48.91 69.07,48.91 68.56,49.42 59.16,49.42 56.27,52.31 U1.11
NET-(BT8-PAD2): length 38.5
  Top Layer w0.3: BT8.2 91,47.06 89.91,48.15 85.96,48.15 83.93,50.18 60.68,50.18 58.81,52.05 U1.12
NET-(C8-PAD1): length 3.4
  Top Layer w0.2: C8.1 15.33,30 16.2,29.13 U2.5
NET-(C9-PAD1): length 3.4
  Top Layer w0.2: U3.5 48.2,29.13 47.33,30 C9.1
NET-(C10-PAD1): length 3.4
  Top Layer w0.2: U4.5 80.2,29.13 79.33,30 C10.1
NET-(R1-PAD1): length 9.1
  Top Layer w0.2: U2.7 9.8,27.4 8.18,29.03 8.18,30
NET-(R2-PAD1): length 9.1
  Top Layer w0.2: R2.1 40.18,29.03 41.8,27.4 U3.7
NET-(R3-PAD1): length 9.1
  Top Layer w0.2: U4.7 73.8,27.4 72.18,29.03 R3.1
NET-(R4-PAD1): length 8.7
  Top Layer w0.3: RGB0.2 91.53,63.5 90.78,62.75 U8.4 88.05,63.89 87.93,64.02 R4.1
NET-(R4-PAD2): length 25.2
  Top Layer w0.3: R4.2 86.28,64.47 87.1,63.64 U8.2 87.1,59.32 86.34,58.56 73.64,58.56 71.51,56.43 U1.17
NET-(R20-PAD1): length 2.2
  Top Layer w0.3: USB1.4 R20.1
NET-(R21-PAD1): length 2.2
  Top Layer w0.3: USB1.10 R21.1
NET-(U1-PADTP2): length 19.5
  Top Layer w0.3: U1.TP2 22.24,65 21.06,66.18 21.06,70.25 21.75,70.94 USB1.5 21.75,73.37 21.48,73.64 21.07,73.64 20.75,73.32 USB1.7
NET-(U1-PADTP3): length 19.4
  Top Layer w0.3: 20.55,70.83 20.55,65.93 23.48,63 U1.TP3 ; 20.55,70.83 20.8,70.83 21.25,71.28 USB1.6 ; 20.55,70.83 20.25,71.13 USB1.8
UNCONNECTED-(USB1-PAD13): length 17
  Top Layer w0.3: USB1.13 USB1.13 ; USB1.13 USB1.13
  Bottom Layer w0.3: USB1.13 USB1.13

## Copper pours and planes (outline as drawn; the poured copper is in the pictures)
GND on Top Layer: 98.28,-0.62 -0.28,-0.62 -0.28,80.41 98.28,80.41
GND on Bottom Layer: 98.28,-0.62 -0.28,-0.62 -0.28,80.41 98.28,80.41

## Text on the board
Top Silkscreen Layer: For TDX use / Tatanako v1.0 | Mai Pico v1.0
